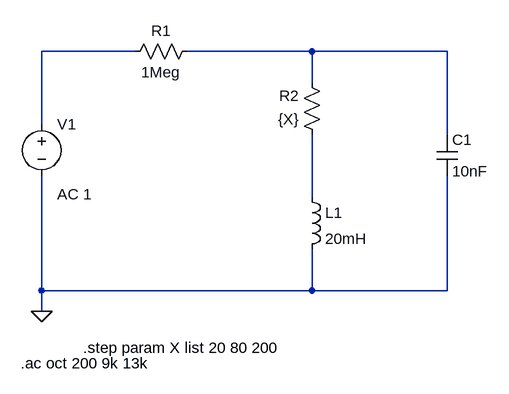
[diagram p0: schematic RLC.asc]
RLC.asc, the LTspice schematic file:
Version 4.1
SHEET 1 880 680
WIRE 96 16 -48 16
WIRE 368 16 176 16
WIRE 576 16 368 16
WIRE 368 64 368 16
WIRE -48 128 -48 16
WIRE 576 144 576 16
WIRE 368 240 368 144
WIRE -48 384 -48 208
WIRE 368 384 368 320
WIRE 368 384 -48 384
WIRE 576 384 576 208
WIRE 576 384 368 384
WIRE -48 416 -48 384
FLAG -48 416 0
SYMBOL voltage -48 112 R0
WINDOW 123 24 124 Left 2
WINDOW 39 0 0 Left 0
SYMATTR InstName V1
SYMATTR Value ""
SYMATTR Value2 AC 1
SYMBOL res 192 0 R90
WINDOW 0 0 56 VBottom 2
WINDOW 3 32 56 VTop 2
SYMATTR InstName R1
SYMATTR Value 1Meg
SYMBOL res 384 160 R180
WINDOW 0 36 76 Left 2
WINDOW 3 36 40 Left 2
SYMATTR InstName R2
SYMATTR Value {X}
SYMBOL ind 352 224 R0
SYMATTR InstName L1
SYMATTR Value 20mH
SYMBOL cap 560 144 R0
SYMATTR InstName C1
SYMATTR Value 10nF
TEXT 16 472 Left 2 !.step param X list 20 80 200
TEXT -80 496 Left 2 !.ac oct 200 9k 13k

The netlist it stands for:
* RLC.asc
V1 N001 0 AC 1
R1 N002 N001 1Meg
R2 N003 N002 {X}
L1 N003 0 20mH
C1 N002 0 10nF
.step param X list 20 80 200
.ac oct 200 9k 13k
.backanno
.end